# EAGLE design ng-beacon (EAGLE 8.0.2)
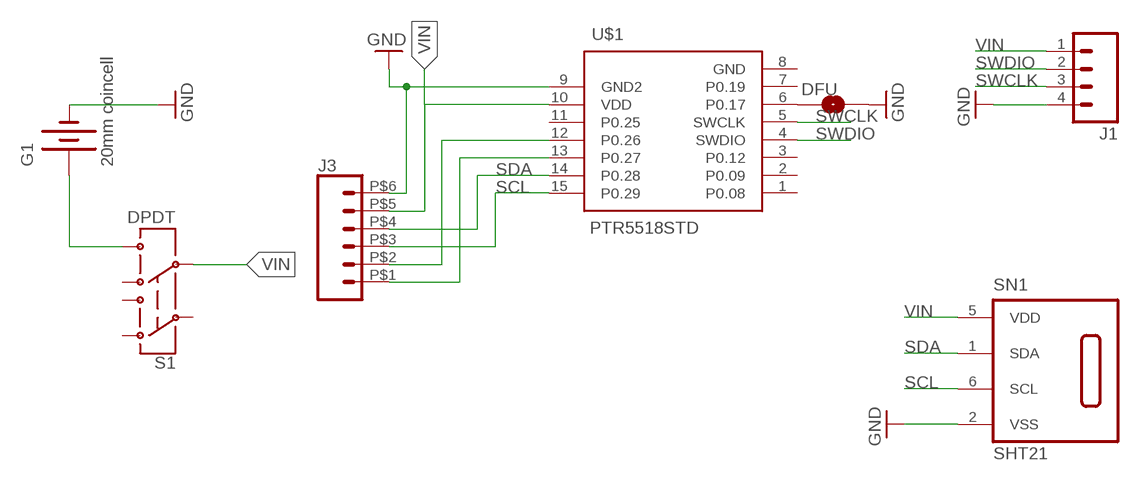
[diagram p0: schematic, sheet 1]

## Parts
DFU  JUMPER-PAD-2-NO  [PAD-JUMPER-2-NO_NO_SILK]
G1  20mm coincell  BATTERY20MM_4LEGS  [BATTCON_20MM_4LEGS]
J1  M04LOCK  [1X04_LOCK]
J3  CONN_06  [PROTO4X6]
S1  DPDT  SWITCH-DPDTAYZ0202  [AYZ0202]
SN1  SHT21  [DFN6/SHT]
U$1  PTR5518STD  [PTR5518]

## Nets
GND: DFU.2 G1.NEGATIVE(-) J1.4 J3.P$6 SN1.2(VSS) U$1.9(GND2)
N$1: G1.POSITIVE@1(+) G1.POSITIVE@2(+) G1.POSITIVE@3(+) G1.POSITIVE@4(+) S1.6
N$4: DFU.1 U$1.6(P0.17)
N$5: J3.P$2 U$1.12(P0.26)
N$6: J3.P$1 U$1.13(P0.27)
SCL: J3.P$3 SN1.6(SCL) U$1.15(P0.29)
SDA: J3.P$4 SN1.1(SDA) U$1.14(P0.28)
SWCLK: J1.3 U$1.5(SWCLK)
SWDIO: J1.2 U$1.4(SWDIO)
VIN: J1.1 J3.P$5 S1.5 SN1.5(VDD) U$1.10(VDD)
Unconnected: S1.1 S1.2 S1.3 S1.4 U$1.1(P0.08) U$1.2(P0.09) U$1.3(P0.12) U$1.7(P0.19) U$1.11(P0.25)

## Power pins joined to a net without a drawn wire
GND: U$1.8(GND)

## Library data of the parts
DFU = SparkFun-Passives:JUMPER-PAD-2-NO
G1 = SparkFun-Electromechanical:BATTERY: Battery Holders Various common sizes : AA, AAA, 18650 (PRT-12895), 20mm coin cell and 12mm coin cell. 20MM_4LEGS, BATT-10373; PROD_ID: BATT-10373
J1 = SparkFun-Connectors:M04: Header 4 Standard 4-pin 0.1" header. Use with straight break away headers (SKU : PRT-00116), right angle break away headers (PRT-00553), swiss pins (PRT-00743), machine pins (PRT-00117), and female headers (PRT-00115). Molex polarized connector foot print use with SKU : PRT-08231 with associated crimp pins and housings. 1MM SMD Version SKU: PRT-10208; PROD_ID: CONN-09696
J3 = heathkit:CONN_06: Multi connection point. Often used as Generic Header-pin footprint for 0.1 inch spaced/style header connections On any of the 0.1 inch spaced packages, you can populate with these: Break Away Headers - Straight <https://www.sparkfun.com/products/116> (PRT-00116) Break Away Male Headers - Right Angle <https://www.sparkfun.com/products/553> (PRT-00553) Female Headers <https://www.sparkfun.com/products/115> (PRT-00115) Break Away Headers - Machine Pin <https://www.sparkfun.com/products/117> (PRT-00117) Break Away Female Headers - Swiss Machine Pin <https://www.sparkfun.com/products/743> (PRT-00743) Arduino Stackable Header - 6 Pin <https://www.sparkfun.com/products/9280> (PRT-09280) For SCREWTERMINALS and SPRING TERMINALS visit here: Screw Terimnals on SparkFun.com <https://www.sparkfun.com/search/results?term=Screw+Terminals> (5mm/3.5mm/2.54mm spacing) This device is also useful as a general connection point to wire up your design to another part of your project. Our various solder wires solder well into these plated through hole pads. Hook-Up Wire - Assortment (Stranded, 22 AWG) <https://www.sparkfun.com/products/11375> (PRT-11375) Hook-Up Wire - Assortment (Solid Core, 22 AWG) <https://www.sparkfun.com/products/11367> (PRT-11367) View the entire wire category on our website here <https://www.sparkfun.com/categories/141>
S1 = SparkFun-Electromechanical:SWITCH-DPDT: DPDT Version of the COM-00597; PROD_ID: SWCH-08179
SN1 = sensirion:SHT21: Humidity and Temperature Sensor
U$1 = PTR5518:PTR5518: nRF51822-based breakout board

## Board
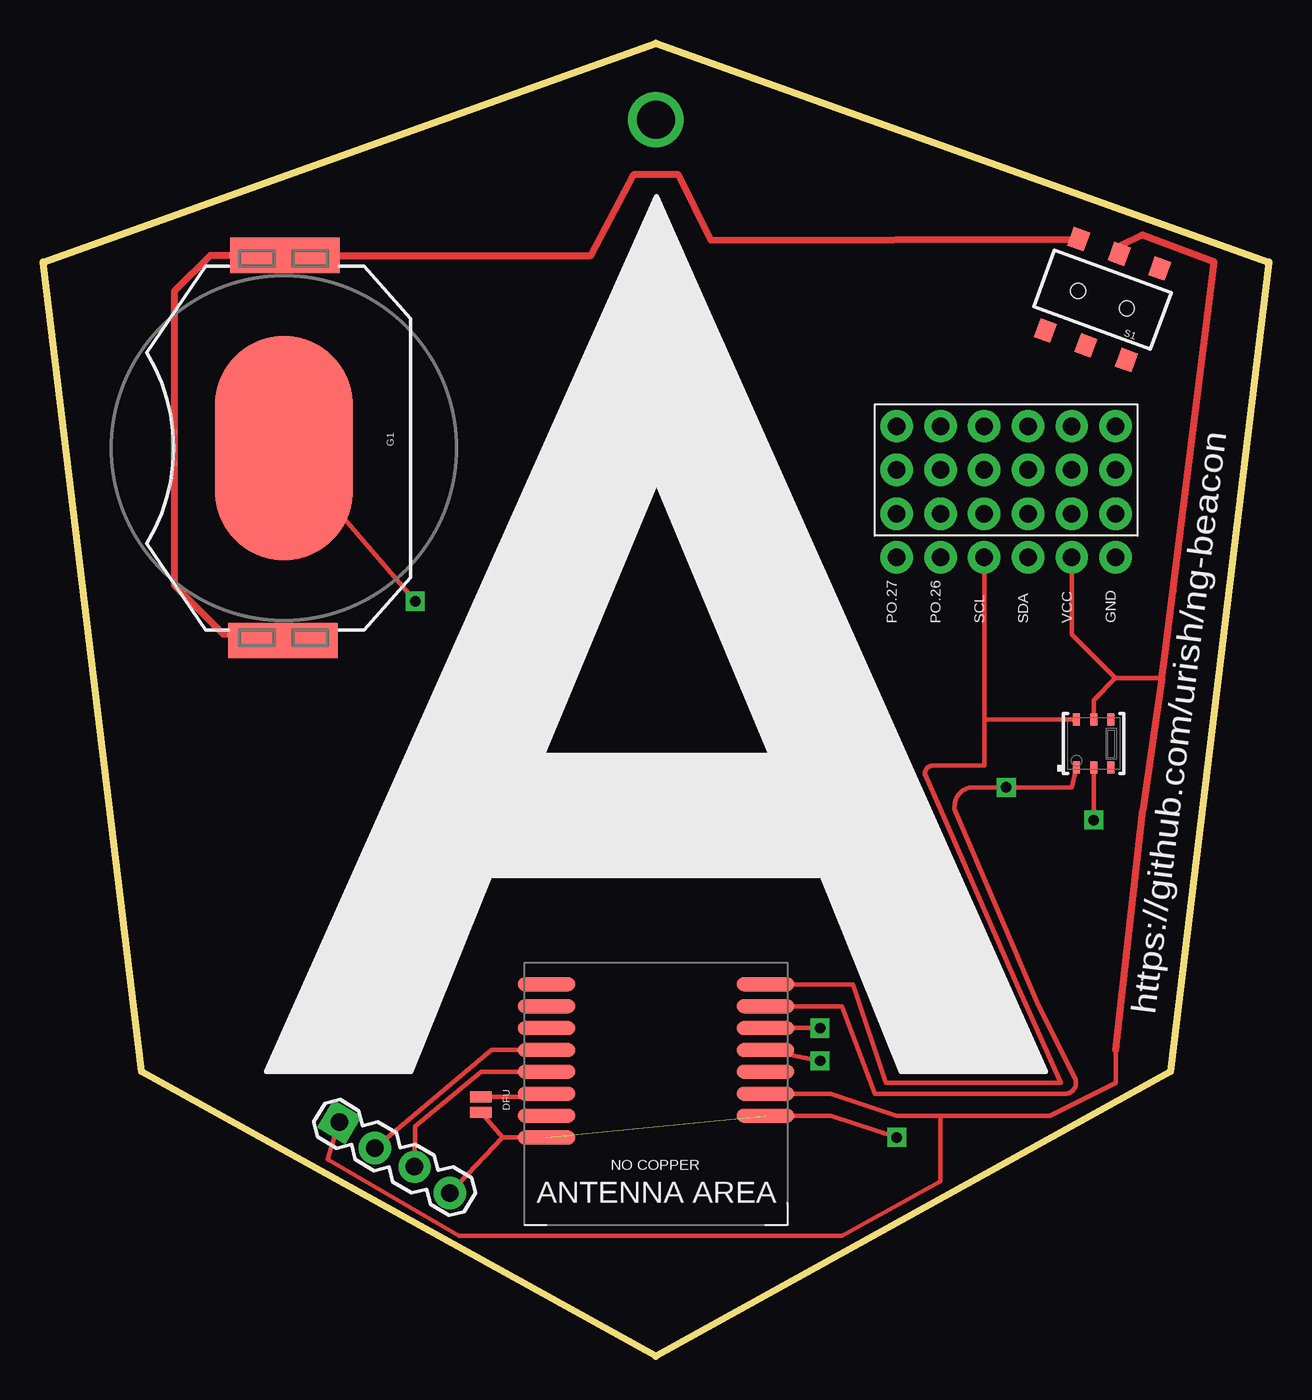
[diagram p1: board, top side]
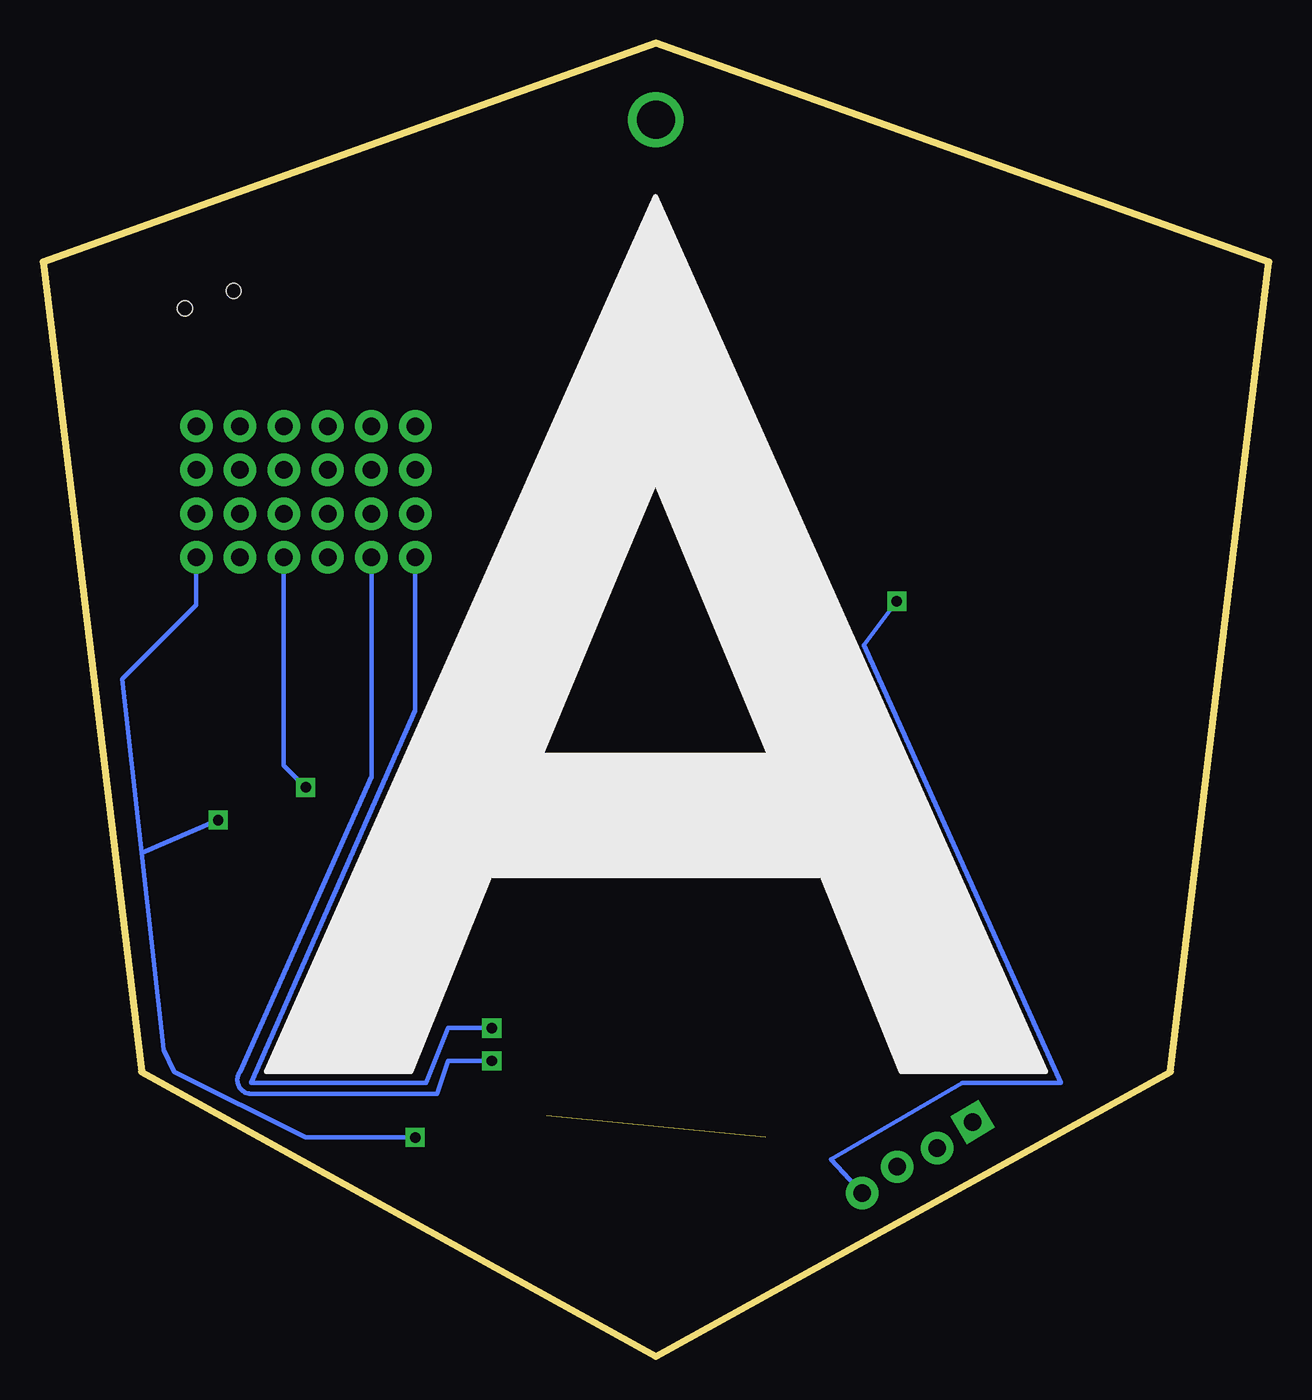
[diagram p2: board, bottom side, seen from below]

Size 71.12 x 76.2 mm. Coordinates in mm from the lower left corner, seen from the top.
Outline: 0,63.5 35.56,76.2 71.12,63.5 65.41,16.51 35.56,0 5.71,16.51 0,63.5
Copper layers (1*16): Top 0.035mm / dielectric 1.5mm / Bottom 0.035mm
Design rules "SparkFun-2-layer-STANDARD *": minimum track width 10mil, minimum drill 20mil, track to track 10mil, track to pad 8mil, pad to pad 8mil, via to via 10mil, smd to smd 8mil, copper to edge 8mil, drill to drill 8mil, minimum pad ring 10mil, minimum via ring 10mil, stop-mask expansion 4mil, vias tented up to drill 25mil, thermal gap 10mil

### Footprints (pad centres in the part's own frame; a part is rotated, then mirrored left to right if it is on the bottom)
PAD-JUMPER-2-NO_NO_SILK = smd 0.635 x 1.27: 1 -0.45,0; 2 0.45,0
BATTCON_20MM_4LEGS = smd 13 x 8: NEGATIVE 0,0 | smd 2.032 x 3.175: POSITIVE@1 -11.176,1.651; POSITIVE@2 -11.176,-1.524; POSITIVE@3 11.176,1.524; POSITIVE@4 11.176,-1.651
1X04_LOCK = drill 1.016 pad 1.88 square: 1 0,0.127 | drill 1.016 pad 1.88: 2 2.54,-0.127; 3 5.08,0.127; 4 7.62,-0.127
PROTO4X6 = drill 1.016 pad 1.88: P$1 0,0; P$2 0,-2.54; P$3 0,-5.08; P$4 0,-7.62; P$5 0,-10.16; P$6 0,-12.7; P$7 2.54,0; P$8 2.54,-2.54; P$9 2.54,-5.08; P$10 2.54,-7.62; P$11 2.54,-10.16; P$12 2.54,-12.7; P$13 5.08,0; P$14 5.08,-2.54; P$15 5.08,-5.08; P$16 5.08,-7.62; P$17 5.08,-10.16; P$18 5.08,-12.7; P$19 7.62,0; P$20 7.62,-2.54; P$21 7.62,-5.08; P$22 7.62,-7.62; P$23 7.62,-10.16; P$24 7.62,-12.7
AYZ0202 = smd 1 x 1.15: 1 -2.5,2.825; 2 0,2.825; 3 2.5,2.825; 4 -2.5,-2.825; 5 0,-2.825; 6 2.5,-2.825 | hole 0.85: 1.5,0; -1.5,0
DFN6/SHT = smd 0.4 x 0.7: 1 -1,-1.4; 2 0,-1.4; 3 1,-1.4; 4 1,1.4; 5 0,1.4; 6 -1,1.4
PTR5518 = smd 3.353 x 0.813: 1 6.35,-6.35; 2 6.35,-5.08; 3 6.35,-3.81; 4 6.35,-2.54; 5 6.35,-1.27; 6 6.35,0; 7 6.35,1.27; 8 6.35,2.54; 9 -6.35,1.27; 10 -6.35,0; 11 -6.35,-1.27; 12 -6.35,-2.54; 13 -6.35,-3.81; 14 -6.35,-5.08; 15 -6.35,-6.35

### Placement (x,y rotation side)
DFU  25.4,14.61 270 top
G1  13.97,52.71 270 top
J1  17.13,13.49 329.2 top
J3  49.53,46.36 90 top
S1  61.47,61.32 160 top
SN1  60.96,35.56 0 top
U$1  35.56,15.24 180 top

### Tracks (layer width: path | path; a pad name or v marks a point on that pad's centre or on a via)
GND  (via drill 0.6)  (1 unrouted)
  Top 0.254: v49.53,12.7 45.72,13.97 U$1.9 | U$1.8 26.67,12.7 | 26.67,12.7 DFU.2 | 26.67,12.7 J1.4 | v21.59,43.82 G1.NEGATIVE | v60.96,31.11 SN1.2
  Bottom 0.254: v60.96,31.11 65.41,29.21 | 65.41,29.21 64.14,17.78 63.5,16.51 55.88,12.7 v49.53,12.7 | J1.4 25.4,11.43 17.78,15.88 12.07,15.88 23.5,41.28 v21.59,43.82 | 65.41,29.21 66.52,39.32 62.23,43.61 J3.P$6
N$1
  Top 0.254: G1.POSITIVE@2 16.51,63.88
  Top 0.406: S1.6 38.73,64.77 36.83,68.58 34.29,68.58 31.79,63.88 16.51,63.88 G1.POSITIVE@1 G1.POSITIVE@2 9.7,63.88 7.62,61.8 7.62,44.75 10.46,41.91 12.07,41.91 12.07,41.28 12.7,41.28 | 12.7,41.28 12.7,41.91 12.32,41.91 G1.POSITIVE@4 | 12.7,41.28 15.49,41.28 G1.POSITIVE@3
N$3  (via drill 2.2)
  other vias: 35.56,71.75
N$4
  Top 0.254: DFU.1 29.21,15.05 U$1.6
N$5  (via drill 0.6)
  Top 0.254: U$1.12 v45.08,17.14
  Bottom 0.254: v45.08,17.14 47.62,17.14 48.26,15.24 59.06,15.24 arc127 59.69,16.51 52.07,33.66 J3.P$2
N$6  (via drill 0.6)
  Top 0.254: U$1.13 v45.08,19.05
  Bottom 0.254: v45.08,19.05 47.62,19.05 48.89,15.88 59.06,15.88 49.53,37.47 J3.P$1
SCL
  Top 0.254: U$1.15 46.99,21.59 48.89,15.88 59.06,15.88 56.52,21.59 52.07,31.75 51.16,33.8 arc-90 51.64,34.29 54.61,34.29 54.61,36.83 | J3.P$3 54.61,36.83 | 54.61,36.83 54.74,36.96 SN1.6
SDA  (via drill 0.6)
  Top 0.254: U$1.14 46.36,20.32 48.26,15.24 59.3,15.24 arc117 59.87,16.16 57.78,20.32 52.89,31.75 52.89,31.93 arc-90 53.98,33.02 v55.88,33.02 59.69,33.02 SN1.1
  Bottom 0.254: v55.88,33.02 57.15,34.29 J3.P$4
SWCLK
  Top 0.254: J1.3 21.59,13.33 25.4,16.51 U$1.5
SWDIO
  Top 0.254: J1.2 26.04,17.78 U$1.4
VIN
  Top 0.254: 62.23,17.78 62.23,15.88 58.42,13.97 52.07,13.97 | 52.07,13.97 49.53,13.97 45.72,15.24 U$1.10 | 52.07,13.97 52.07,10.16 46.36,6.98 24.13,6.98 16.51,11.43 J1.1 | SN1.5 60.96,38.1 62.21,39.35 | 62.21,39.35 64.9,39.35 | J3.P$5 59.69,41.87 62.21,39.35
  Top 0.406: 62.23,17.78 63.81,31.71 64.9,39.35 65.08,40.6 65.55,44.35 67.95,63.5 63.77,65.07 62.59,64.48 S1.5

### Text on the board
tNames: PO.27 | PO.26 | SCL | SDA | VCC | GND | https://github.com/urish/ng-beacon